# EAGLE schematic display (EAGLE 6.3)
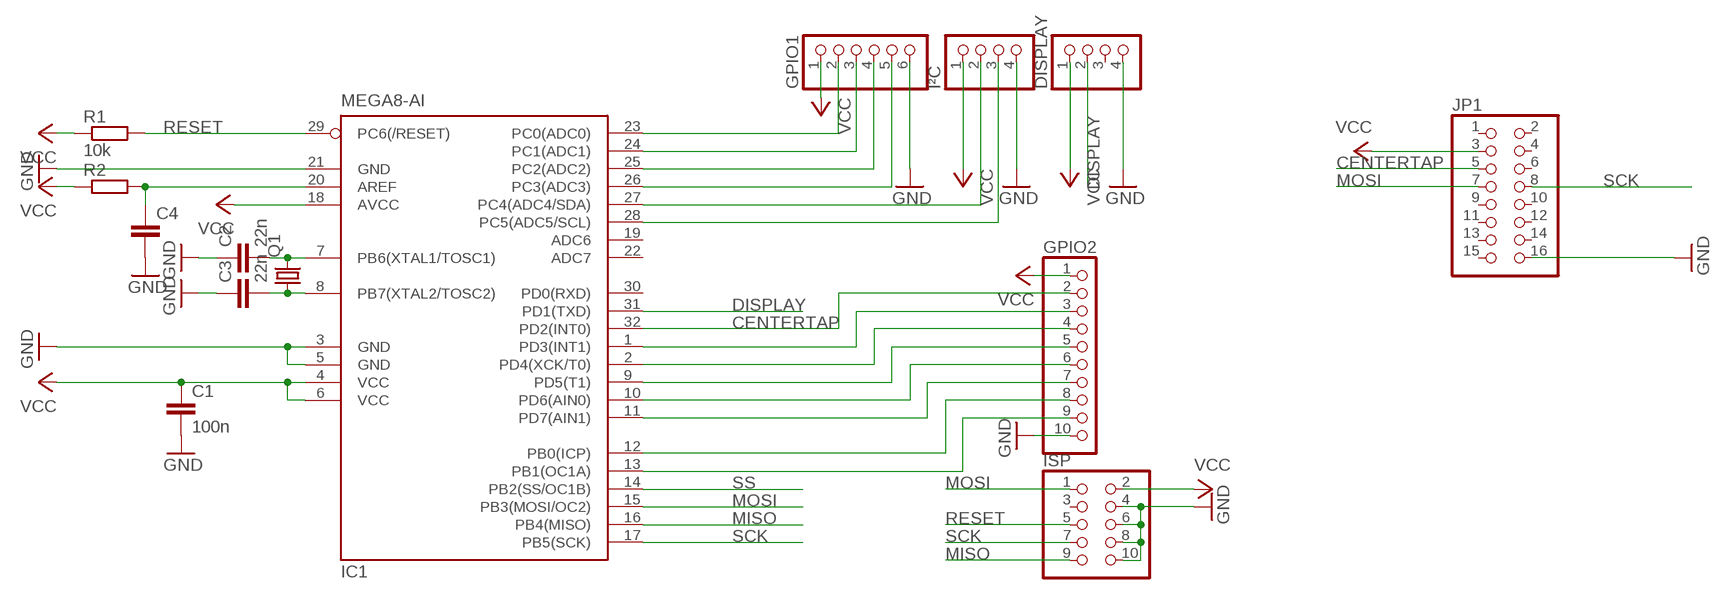
[diagram p0: schematic, sheet 1]

## Parts
C1  100n  C-EUC0805  [C0805]
C2  22n  C-EUC0805  [C0805]
C3  22n  C-EUC0805  [C0805]
C4  C-EUC0805  [C0805]
DISPLAY  PINHD-1X4  [1X04]
GPIO1  PINHD-1X6  [1X06]
GPIO2  PINHD-1X10  [1X10]
IC1  MEGA8-AI  [TQFP32-08]
ISP  PINHD-2X5  [2X05]
I²C  PINHD-1X4  [1X04]
JP1  PINHD-2X8  [2X08]
Q1  CRYSTALSM49  [SM49]
R1  10k  R-EU_R0805  [R0805]
R2  R-EU_R0805  [R0805]

## Nets
CENTERTAP: GPIO2.2 IC1.32(PD2(INT0)) JP1.5
DISPLAY: DISPLAY.2 IC1.31(PD1(TXD))
GND: C1.2 C2.1 C3.1 C4.2 DISPLAY.4 GPIO1.6 GPIO2.10 IC1.3(GND) IC1.5(GND) IC1.21(GND) ISP.4 ISP.6 ISP.8 ISP.10 I²C.4 JP1.16
MISO: IC1.16(PB4(MISO)) ISP.9
MOSI: IC1.15(PB3(MOSI/OC2)) ISP.1 JP1.7
N$1: C3.2 IC1.8(PB7(XTAL2/TOSC2)) Q1.1
N$2: C2.2 IC1.7(PB6(XTAL1/TOSC1)) Q1.2
N$3: IC1.27(PC4(ADC4/SDA)) I²C.2
N$4: IC1.28(PC5(ADC5/SCL)) I²C.3
N$5: GPIO1.5 IC1.26(PC3(ADC3))
N$6: GPIO1.4 IC1.25(PC2(ADC2))
N$7: GPIO1.3 IC1.24(PC1(ADC1))
N$8: GPIO1.2 IC1.23(PC0(ADC0))
N$9: GPIO2.9 IC1.13(PB1(OC1A))
N$10: GPIO2.8 IC1.12(PB0(ICP))
N$11: GPIO2.7 IC1.11(PD7(AIN1))
N$12: GPIO2.6 IC1.10(PD6(AIN0))
N$13: GPIO2.5 IC1.9(PD5(T1))
N$14: GPIO2.4 IC1.2(PD4(XCK/T0))
N$15: GPIO2.3 IC1.1(PD3(INT1))
N$16: C4.1 IC1.20(AREF) R2.2
RESET: IC1.29(PC6(/RESET)) ISP.5 R1.2
SCK: IC1.17(PB5(SCK)) ISP.7 JP1.8
SS: IC1.14(PB2(SS/OC1B))
VCC: C1.1 DISPLAY.1 GPIO1.1 GPIO2.1 IC1.4(VCC) IC1.6(VCC) IC1.18(AVCC) ISP.2 I²C.1 JP1.3 R1.1 R2.1
Unconnected: DISPLAY.3 IC1.19(ADC6) IC1.22(ADC7) IC1.30(PD0(RXD)) ISP.3 JP1.1 JP1.2 JP1.4 JP1.6 JP1.9 JP1.10 JP1.11 JP1.12 JP1.13 JP1.14 JP1.15

## Library data of the parts
C1-C4 = rcl:C-EU: CAPACITOR, European symbol
DISPLAY I²C = pinhead:PINHD-1X4: PIN HEADER
GPIO1 = pinhead:PINHD-1X6: PIN HEADER
GPIO2 = pinhead:PINHD-1X10: PIN HEADER
IC1 = atmel:MEGA8: MICROCONTROLLER 8 Kbytes FLASH, 1 kbytes SRAM, 512 bytes EEPROM, USART, 6-channel 10 bit ADC, 2-channel 8 bit ADC Pin compatible with Atmega48, ATMega88, ATMega168 Source: avr.lbr; MPN: ATMEGA8-16AU; OC_FARNELL: 9171371; OC_NEWARK: 73M8863
ISP = pinhead:PINHD-2X5: PIN HEADER
JP1 = pinhead:PINHD-2X8: PIN HEADER
Q1 = crystal:CRYSTAL: CRYSTAL; OC_FARNELL: unknown; OC_NEWARK: unknown
R1 R2 = rcl:R-EU_: RESISTOR, European symbol